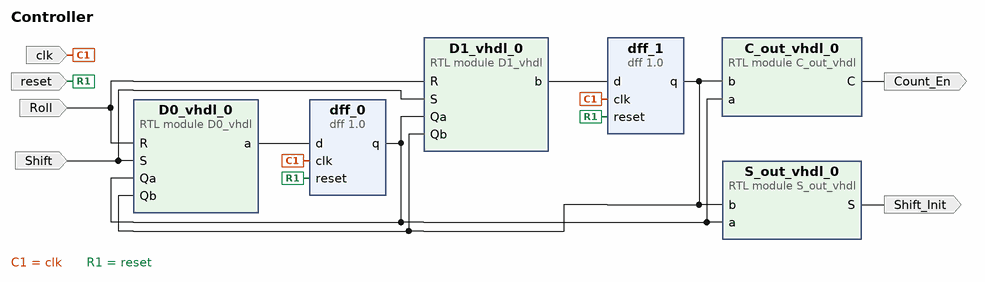
[diagram p0: block diagram of the top level]
# Vivado block design Controller, xc7a35tcpg236-1, Vivado 2018.3
create_bd_design Controller

create_bd_port -dir I -type data Roll
create_bd_port -dir I reset
create_bd_port -dir I clk
create_bd_port -dir I Shift
create_bd_port -dir O Count_En
create_bd_port -dir O Shift_Init

create_bd_cell -type module -reference D0_vhdl D0_vhdl_0
create_bd_cell -type module -reference D1_vhdl D1_vhdl_0
create_bd_cell -type ip -vlnv FIT:user:dff:1.0 dff_0
create_bd_cell -type ip -vlnv FIT:user:dff:1.0 dff_1
create_bd_cell -type module -reference C_out_vhdl C_out_vhdl_0
create_bd_cell -type module -reference S_out_vhdl S_out_vhdl_0

# ---- connections ----

connect_bd_net [get_bd_ports Roll] [get_bd_pins D0_vhdl_0/R] [get_bd_pins D1_vhdl_0/R]
connect_bd_net -net S_0_1 [get_bd_ports Shift] [get_bd_pins D0_vhdl_0/S] [get_bd_pins D1_vhdl_0/S]
connect_bd_net [get_bd_pins D0_vhdl_0/a] [get_bd_pins dff_0/d]
connect_bd_net [get_bd_pins D1_vhdl_0/b] [get_bd_pins dff_1/d]
connect_bd_net [get_bd_pins dff_0/q] [get_bd_pins D0_vhdl_0/Qa] [get_bd_pins D1_vhdl_0/Qa] [get_bd_pins S_out_vhdl_0/a] [get_bd_pins C_out_vhdl_0/a]
connect_bd_net [get_bd_pins dff_1/q] [get_bd_pins D0_vhdl_0/Qb] [get_bd_pins D1_vhdl_0/Qb] [get_bd_pins C_out_vhdl_0/b] [get_bd_pins S_out_vhdl_0/b]
connect_bd_net [get_bd_pins C_out_vhdl_0/C] [get_bd_ports Count_En]
connect_bd_net [get_bd_pins S_out_vhdl_0/S] [get_bd_ports Shift_Init]
connect_bd_net [get_bd_ports clk] [get_bd_pins dff_0/clk] [get_bd_pins dff_1/clk]
connect_bd_net [get_bd_ports reset] [get_bd_pins dff_0/reset] [get_bd_pins dff_1/reset]

validate_bd_design
save_bd_design
